# Altium schematic sheet Accelerometer.SchDoc
size A4; SheetNumber: 6; SheetTotal: 6
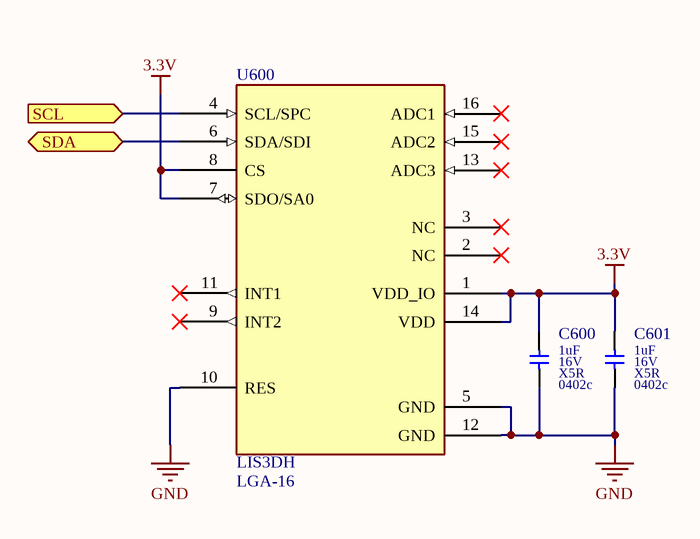
[diagram p0: Accelerometer.SchDoc]

## Parts
C600  11 Parameter 4: X5R  07 Package: 0402c  08 Parameter 1: 1uF  09 Parameter 2: 16V  [CAPC1005X60L]  (hidden comment: CL05A105KO5NNNC)
C601  11 Parameter 4: X5R  07 Package: 0402c  08 Parameter 1: 1uF  09 Parameter 2: 16V  [CAPC1005X60L]  (hidden comment: CL05A105KO5NNNC)
U600  07 Package: LGA-16  [LGA16R50P5X3_300X300X100]  (hidden comment: LIS3DH)

## Ports
SCL (in), SDA (bidir)

## Nets
3.3V: C600.2 C601.2 U600.1(VDD_IO) U600.7(SDO/SA0) U600.8(CS) U600.14(VDD)
GND: C600.1 C601.1 U600.5(GND) U600.10(RES) U600.12(GND)
SCL: U600.4(SCL/SPC) ; port SCL
SDA: U600.6(SDA/SDI) ; port SDA

Not connected (* = marked no-connect by the designer): U600 2(NC)* 3(NC)* 9(INT2)* 11(INT1)* 13(ADC3)* 15(ADC2)* 16(ADC1)*

## Notes on the sheet
- Version:
- SVN Rev:
- Sheet:
- File:
- Modification Date:
- Variant:
- of
- Sheet Size:
- A4
- SaraAI

## Library data of the parts
C600 C601 = 155: SMT 0402c 1uF 16V 10% X5R 11.9MHz 85'C; 03 Manufacturer: Samsung; 00 Index: 155; 01 Name: CAPACITOR THICK FILM CL05A105KO5NNNC Samsung; 05 Sub Group: THICK FILM; 04 Main Group: CAPACITOR; 06 Assembly: SMT; 12 Parameter 5: 11.9MHz; 13 Parameter 6: 85'C; 14 Modification Date: 16.11.2020; ComponentLink1Description: DATASHEET; ComponentLink1URL: E:\Praca\Mindsailors\Mindsailors Altium\Database Library\Datasheets\CAPACITOR\Samsung CL05A105KO5NNN.pdf; 02 MPN: CL05A105KO5NNNC; 10 Parameter 3: 10%
U600 = 158: SMT LGA-16 ACCELEROMETER 1.71V - 3.6V +/- 16g; 03 Manufacturer: STMicroelectronics; 00 Index: 158; 01 Name: IC SENSOR LIS3DH STMicroelectronics; 04 Main Group: IC; 05 Sub Group: SENSOR; 12 Parameter 5: +/- 16g; 06 Assembly: SMT; 11 Parameter 4: 1.71V - 3.6V; 14 Modification Date: 18.12.2020; ComponentLink1Description: DATASHEET; ComponentLink1URL: E:\Praca\Mindsailors\Mindsailors Altium\Database Library\Datasheets\IC\ST lis3dh.pdf; 08 Parameter 1: ACCELEROMETER; 02 MPN: LIS3DH